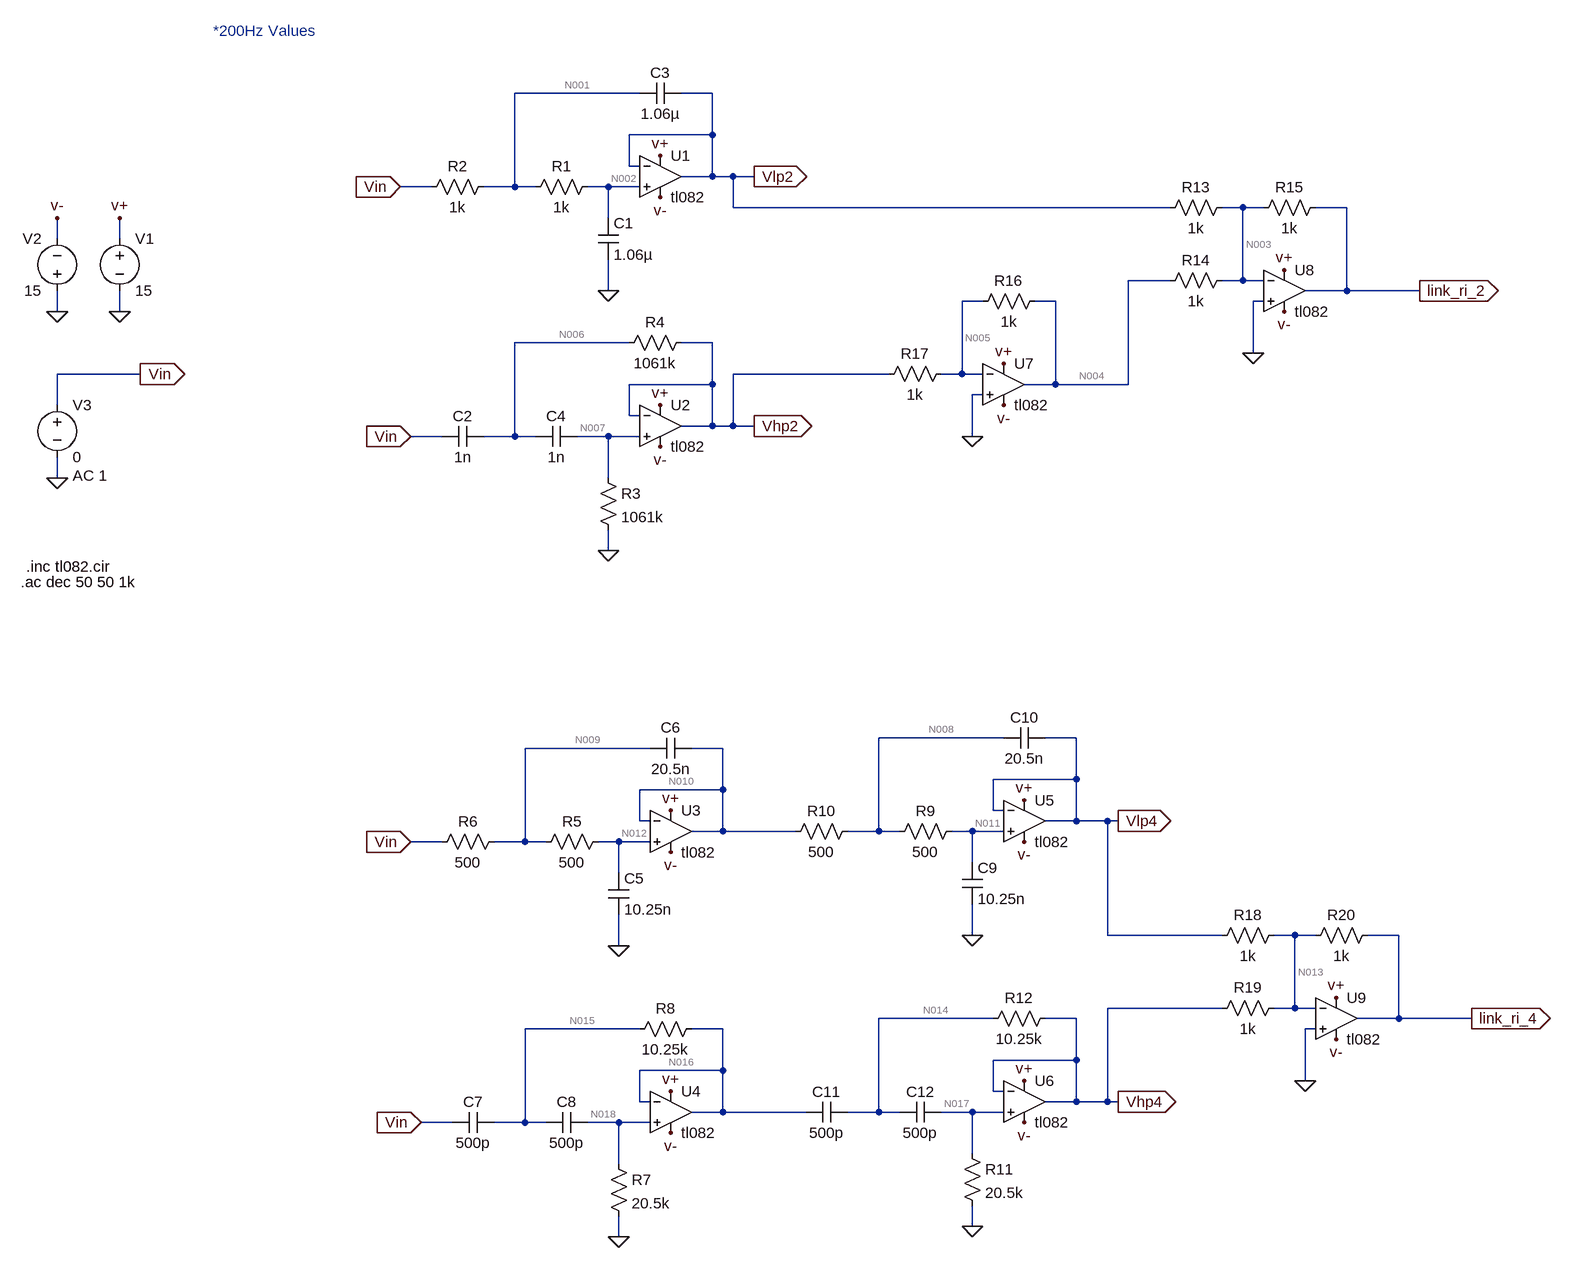
[diagram p0: schematic linkwitz_riley_2nd_order.asc]
linkwitz_riley_2nd_order.asc, the LTspice schematic file:
Version 4
SHEET 1 3200 1796
WIRE 512 16 320 16
WIRE 624 16 576 16
WIRE 624 80 624 16
WIRE 624 80 496 80
WIRE 496 128 496 80
WIRE 512 128 496 128
WIRE 624 144 624 80
WIRE 624 144 576 144
WIRE 656 144 624 144
WIRE 688 144 656 144
WIRE 192 160 144 160
WIRE 320 160 320 16
WIRE 320 160 272 160
WIRE 352 160 320 160
WIRE 464 160 432 160
WIRE 512 160 464 160
WIRE 656 192 656 144
WIRE 1328 192 656 192
WIRE 1440 192 1408 192
WIRE 1472 192 1440 192
WIRE 1600 192 1552 192
WIRE 464 208 464 160
WIRE -384 240 -384 208
WIRE -288 240 -288 208
WIRE 1328 304 1264 304
WIRE 1440 304 1440 192
WIRE 1440 304 1408 304
WIRE 1472 304 1440 304
WIRE 464 320 464 272
WIRE 1600 320 1600 192
WIRE 1600 320 1536 320
WIRE 1712 320 1600 320
WIRE 1040 336 1008 336
WIRE 1152 336 1120 336
WIRE 1472 336 1456 336
WIRE -384 352 -384 320
WIRE -288 352 -288 320
WIRE 496 400 320 400
WIRE 624 400 576 400
WIRE 1456 416 1456 336
WIRE -256 448 -384 448
WIRE 896 448 656 448
WIRE 1008 448 1008 336
WIRE 1008 448 976 448
WIRE 1040 448 1008 448
WIRE 624 464 624 400
WIRE 624 464 496 464
WIRE 1152 464 1152 336
WIRE 1152 464 1104 464
WIRE 1264 464 1264 304
WIRE 1264 464 1152 464
WIRE 1040 480 1024 480
WIRE -384 496 -384 448
WIRE 496 512 496 464
WIRE 512 512 496 512
WIRE 624 528 624 464
WIRE 624 528 576 528
WIRE 656 528 656 448
WIRE 656 528 624 528
WIRE 688 528 656 528
WIRE 208 544 160 544
WIRE 320 544 320 400
WIRE 320 544 272 544
WIRE 352 544 320 544
WIRE 464 544 416 544
WIRE 512 544 464 544
WIRE 1024 544 1024 480
WIRE -384 608 -384 576
WIRE 464 608 464 544
WIRE 464 720 464 688
WIRE 1072 1008 880 1008
WIRE 1184 1008 1136 1008
WIRE 528 1024 336 1024
WIRE 640 1024 592 1024
WIRE 1184 1072 1184 1008
WIRE 1184 1072 1056 1072
WIRE 640 1088 640 1024
WIRE 640 1088 512 1088
WIRE 1056 1120 1056 1072
WIRE 1072 1120 1056 1120
WIRE 512 1136 512 1088
WIRE 528 1136 512 1136
WIRE 1184 1136 1184 1072
WIRE 1184 1136 1136 1136
WIRE 1232 1136 1184 1136
WIRE 1248 1136 1232 1136
WIRE 640 1152 640 1088
WIRE 640 1152 592 1152
WIRE 752 1152 640 1152
WIRE 880 1152 880 1008
WIRE 880 1152 832 1152
WIRE 912 1152 880 1152
WIRE 1024 1152 992 1152
WIRE 1072 1152 1024 1152
WIRE 208 1168 160 1168
WIRE 336 1168 336 1024
WIRE 336 1168 288 1168
WIRE 368 1168 336 1168
WIRE 480 1168 448 1168
WIRE 528 1168 480 1168
WIRE 1024 1200 1024 1152
WIRE 480 1216 480 1168
WIRE 1024 1312 1024 1264
WIRE 1232 1312 1232 1136
WIRE 1408 1312 1232 1312
WIRE 1520 1312 1488 1312
WIRE 1552 1312 1520 1312
WIRE 1680 1312 1632 1312
WIRE 480 1328 480 1280
WIRE 1408 1424 1232 1424
WIRE 1520 1424 1520 1312
WIRE 1520 1424 1488 1424
WIRE 1552 1424 1520 1424
WIRE 1056 1440 880 1440
WIRE 1184 1440 1136 1440
WIRE 1680 1440 1680 1312
WIRE 1680 1440 1616 1440
WIRE 1792 1440 1680 1440
WIRE 512 1456 336 1456
WIRE 640 1456 592 1456
WIRE 1552 1456 1536 1456
WIRE 1184 1504 1184 1440
WIRE 1184 1504 1056 1504
WIRE 640 1520 640 1456
WIRE 640 1520 512 1520
WIRE 1536 1536 1536 1456
WIRE 1056 1552 1056 1504
WIRE 1072 1552 1056 1552
WIRE 512 1568 512 1520
WIRE 528 1568 512 1568
WIRE 1184 1568 1184 1504
WIRE 1184 1568 1136 1568
WIRE 1232 1568 1232 1424
WIRE 1232 1568 1184 1568
WIRE 1248 1568 1232 1568
WIRE 640 1584 640 1520
WIRE 640 1584 592 1584
WIRE 768 1584 640 1584
WIRE 880 1584 880 1440
WIRE 880 1584 832 1584
WIRE 912 1584 880 1584
WIRE 1024 1584 976 1584
WIRE 1072 1584 1024 1584
WIRE 224 1600 176 1600
WIRE 336 1600 336 1456
WIRE 336 1600 288 1600
WIRE 368 1600 336 1600
WIRE 480 1600 432 1600
WIRE 528 1600 480 1600
WIRE 1024 1648 1024 1584
WIRE 480 1664 480 1600
WIRE 1024 1760 1024 1728
WIRE 480 1776 480 1744
FLAG 544 112 v+
FLAG 544 496 v+
FLAG -288 208 v+
FLAG 544 176 v-
FLAG 544 560 v-
FLAG -384 208 v-
FLAG -384 352 0
FLAG -288 352 0
FLAG 688 144 Vlp2
IOPIN 688 144 Out
FLAG 688 528 Vhp2
IOPIN 688 528 Out
FLAG 464 320 0
FLAG 464 720 0
FLAG 144 160 Vin
IOPIN 144 160 In
FLAG 160 544 Vin
IOPIN 160 544 In
FLAG -256 448 Vin
IOPIN -256 448 Out
FLAG -384 608 0
FLAG 560 1120 v+
FLAG 560 1184 v-
FLAG 480 1328 0
FLAG 160 1168 Vin
IOPIN 160 1168 In
FLAG 560 1552 v+
FLAG 560 1616 v-
FLAG 480 1776 0
FLAG 176 1600 Vin
IOPIN 176 1600 In
FLAG 1104 1104 v+
FLAG 1104 1168 v-
FLAG 1248 1136 Vlp4
IOPIN 1248 1136 Out
FLAG 1024 1312 0
FLAG 1104 1536 v+
FLAG 1104 1600 v-
FLAG 1248 1568 Vhp4
IOPIN 1248 1568 Out
FLAG 1024 1760 0
FLAG 1072 432 v+
FLAG 1072 496 v-
FLAG 1504 288 v+
FLAG 1504 352 v-
FLAG 1456 416 0
FLAG 1712 320 link_ri_2
IOPIN 1712 320 Out
FLAG 1024 544 0
FLAG 1584 1408 v+
FLAG 1584 1472 v-
FLAG 1536 1536 0
FLAG 1792 1440 link_ri_4
IOPIN 1792 1440 Out
SYMBOL OpAmps\\opamp2 544 80 R0
SYMATTR InstName U1
SYMATTR Value tl082
SYMBOL OpAmps\\opamp2 544 464 R0
SYMATTR InstName U2
SYMATTR Value tl082
SYMBOL voltage -288 224 R0
SYMATTR InstName V1
SYMATTR Value 15
SYMBOL voltage -384 336 R180
WINDOW 0 24 96 Left 2
WINDOW 3 24 16 Left 2
SYMATTR InstName V2
SYMATTR Value 15
SYMBOL voltage -384 480 R0
WINDOW 123 24 124 Left 2
WINDOW 39 0 0 Left 0
SYMATTR Value2 AC 1
SYMATTR InstName V3
SYMATTR Value 0
SYMBOL res 448 144 R90
WINDOW 0 0 56 VBottom 2
WINDOW 3 32 56 VTop 2
SYMATTR InstName R1
SYMATTR Value 1k
SYMBOL res 288 144 R90
WINDOW 0 0 56 VBottom 2
WINDOW 3 32 56 VTop 2
SYMATTR InstName R2
SYMATTR Value 1k
SYMBOL cap 448 208 R0
SYMATTR InstName C1
SYMATTR Value 1.06µ
SYMBOL cap 576 0 R90
WINDOW 0 0 32 VBottom 2
WINDOW 3 32 32 VTop 2
SYMATTR InstName C3
SYMATTR Value 1.06µ
SYMBOL res 448 592 R0
SYMATTR InstName R3
SYMATTR Value 1061k
SYMBOL res 592 384 R90
WINDOW 0 0 56 VBottom 2
WINDOW 3 32 56 VTop 2
SYMATTR InstName R4
SYMATTR Value 1061k
SYMBOL cap 272 528 R90
WINDOW 0 0 32 VBottom 2
WINDOW 3 32 32 VTop 2
SYMATTR InstName C2
SYMATTR Value 1n
SYMBOL cap 416 528 R90
WINDOW 0 0 32 VBottom 2
WINDOW 3 32 32 VTop 2
SYMATTR InstName C4
SYMATTR Value 1n
SYMBOL OpAmps\\opamp2 560 1088 R0
SYMATTR InstName U3
SYMATTR Value tl082
SYMBOL res 464 1152 R90
WINDOW 0 0 56 VBottom 2
WINDOW 3 32 56 VTop 2
SYMATTR InstName R5
SYMATTR Value 500
SYMBOL res 304 1152 R90
WINDOW 0 0 56 VBottom 2
WINDOW 3 32 56 VTop 2
SYMATTR InstName R6
SYMATTR Value 500
SYMBOL cap 464 1216 R0
SYMATTR InstName C5
SYMATTR Value 10.25n
SYMBOL cap 592 1008 R90
WINDOW 0 0 32 VBottom 2
WINDOW 3 32 32 VTop 2
SYMATTR InstName C6
SYMATTR Value 20.5n
SYMBOL OpAmps\\opamp2 560 1520 R0
SYMATTR InstName U4
SYMATTR Value tl082
SYMBOL res 464 1648 R0
SYMATTR InstName R7
SYMATTR Value 20.5k
SYMBOL res 608 1440 R90
WINDOW 0 0 56 VBottom 2
WINDOW 3 32 56 VTop 2
SYMATTR InstName R8
SYMATTR Value 10.25k
SYMBOL cap 288 1584 R90
WINDOW 0 0 32 VBottom 2
WINDOW 3 32 32 VTop 2
SYMATTR InstName C7
SYMATTR Value 500p
SYMBOL cap 432 1584 R90
WINDOW 0 0 32 VBottom 2
WINDOW 3 32 32 VTop 2
SYMATTR InstName C8
SYMATTR Value 500p
SYMBOL OpAmps\\opamp2 1104 1072 R0
SYMATTR InstName U5
SYMATTR Value tl082
SYMBOL res 1008 1136 R90
WINDOW 0 0 56 VBottom 2
WINDOW 3 32 56 VTop 2
SYMATTR InstName R9
SYMATTR Value 500
SYMBOL res 848 1136 R90
WINDOW 0 0 56 VBottom 2
WINDOW 3 32 56 VTop 2
SYMATTR InstName R10
SYMATTR Value 500
SYMBOL cap 1008 1200 R0
SYMATTR InstName C9
SYMATTR Value 10.25n
SYMBOL cap 1136 992 R90
WINDOW 0 0 32 VBottom 2
WINDOW 3 32 32 VTop 2
SYMATTR InstName C10
SYMATTR Value 20.5n
SYMBOL OpAmps\\opamp2 1104 1504 R0
SYMATTR InstName U6
SYMATTR Value tl082
SYMBOL res 1008 1632 R0
SYMATTR InstName R11
SYMATTR Value 20.5k
SYMBOL res 1152 1424 R90
WINDOW 0 0 56 VBottom 2
WINDOW 3 32 56 VTop 2
SYMATTR InstName R12
SYMATTR Value 10.25k
SYMBOL cap 832 1568 R90
WINDOW 0 0 32 VBottom 2
WINDOW 3 32 32 VTop 2
SYMATTR InstName C11
SYMATTR Value 500p
SYMBOL cap 976 1568 R90
WINDOW 0 0 32 VBottom 2
WINDOW 3 32 32 VTop 2
SYMATTR InstName C12
SYMATTR Value 500p
SYMBOL OpAmps\\opamp2 1072 400 R0
SYMATTR InstName U7
SYMATTR Value tl082
SYMBOL OpAmps\\opamp2 1504 256 R0
SYMATTR InstName U8
SYMATTR Value tl082
SYMBOL res 1424 176 R90
WINDOW 0 0 56 VBottom 2
WINDOW 3 32 56 VTop 2
SYMATTR InstName R13
SYMATTR Value 1k
SYMBOL res 1424 288 R90
WINDOW 0 0 56 VBottom 2
WINDOW 3 32 56 VTop 2
SYMATTR InstName R14
SYMATTR Value 1k
SYMBOL res 1568 176 R90
WINDOW 0 0 56 VBottom 2
WINDOW 3 32 56 VTop 2
SYMATTR InstName R15
SYMATTR Value 1k
SYMBOL res 1136 320 R90
WINDOW 0 0 56 VBottom 2
WINDOW 3 32 56 VTop 2
SYMATTR InstName R16
SYMATTR Value 1k
SYMBOL res 992 432 R90
WINDOW 0 0 56 VBottom 2
WINDOW 3 32 56 VTop 2
SYMATTR InstName R17
SYMATTR Value 1k
SYMBOL OpAmps\\opamp2 1584 1376 R0
SYMATTR InstName U9
SYMATTR Value tl082
SYMBOL res 1504 1296 R90
WINDOW 0 0 56 VBottom 2
WINDOW 3 32 56 VTop 2
SYMATTR InstName R18
SYMATTR Value 1k
SYMBOL res 1504 1408 R90
WINDOW 0 0 56 VBottom 2
WINDOW 3 32 56 VTop 2
SYMATTR InstName R19
SYMATTR Value 1k
SYMBOL res 1648 1296 R90
WINDOW 0 0 56 VBottom 2
WINDOW 3 32 56 VTop 2
SYMATTR InstName R20
SYMATTR Value 1k
TEXT -432 744 Left 2 !.inc tl082.cir
TEXT -440 768 Left 2 !.ac dec 50 50 1k
TEXT -144 -80 Left 2 ;*200Hz Values

The netlist it stands for:
* linkwitz_riley_2nd_order.asc
XU1 N002 Vlp2 v+ v- Vlp2 tl082  ; pins In+ In- V+ V- OUT
XU2 N007 Vhp2 v+ v- Vhp2 tl082  ; pins In+ In- V+ V- OUT
V1 v+ 0 15
V2 0 v- 15
V3 Vin 0 0 AC 1
R1 N002 N001 1k
R2 N001 Vin 1k
C1 N002 0 1.06µ
C3 Vlp2 N001 1.06µ
R3 N007 0 1061k
R4 Vhp2 N006 1061k
C2 N006 Vin 1n
C4 N007 N006 1n
XU3 N012 N010 v+ v- N010 tl082  ; pins In+ In- V+ V- OUT
R5 N012 N009 500
R6 N009 Vin 500
C5 N012 0 10.25n
C6 N010 N009 20.5n
XU4 N018 N016 v+ v- N016 tl082  ; pins In+ In- V+ V- OUT
R7 N018 0 20.5k
R8 N016 N015 10.25k
C7 N015 Vin 500p
C8 N018 N015 500p
XU5 N011 Vlp4 v+ v- Vlp4 tl082  ; pins In+ In- V+ V- OUT
R9 N011 N008 500
R10 N008 N010 500
C9 N011 0 10.25n
C10 Vlp4 N008 20.5n
XU6 N017 Vhp4 v+ v- Vhp4 tl082  ; pins In+ In- V+ V- OUT
R11 N017 0 20.5k
R12 Vhp4 N014 10.25k
C11 N014 N016 500p
C12 N017 N014 500p
XU7 0 N005 v+ v- N004 tl082  ; pins In+ In- V+ V- OUT
XU8 0 N003 v+ v- link_ri_2 tl082  ; pins In+ In- V+ V- OUT
R13 N003 Vlp2 1k
R14 N003 N004 1k
R15 link_ri_2 N003 1k
R16 N004 N005 1k
R17 N005 Vhp2 1k
XU9 0 N013 v+ v- link_ri_4 tl082  ; pins In+ In- V+ V- OUT
R18 N013 Vlp4 1k
R19 N013 Vhp4 1k
R20 link_ri_4 N013 1k
.inc tl082.cir
.ac dec 50 50 1k
* *200Hz Values
.backanno
.end

* Results of the author's LTspice run, read from the files saved beside the schematic
* Operating Point, zero values left out:
*   V(vlp2) = 10.88 µV
*   V(v-) = -15 V
*   V(v+) = 15 V
*   V(n002) = -90.11 nV
*   V(vhp2) = -36.83 µV
*   V(n007) = -47.8 µV
*   V(n001) = -45.05 nV
*   V(n006) = -36.83 µV
*   V(n010) = 10.93 µV
*   V(n012) = -45.05 nV
*   V(n009) = -22.53 nV
*   V(n016) = 10.05 µV
*   V(n018) = -923.6 nV
*   V(n015) = 10.05 µV
*   V(vlp4) = 21.85 µV
*   V(n011) = 10.88 µV
*   V(n008) = 10.9 µV
*   V(vhp4) = 10.05 µV
*   V(n017) = -923.6 nV
*   V(n014) = 10.05 µV
*   V(n004) = 58.81 µV
*   V(n005) = 10.97 µV
*   V(link_ri_2) = -36.74 µV
*   V(n003) = 10.97 µV
*   V(link_ri_4) = 1.059 µV
*   V(n013) = 10.97 µV
*   I(R20) = -9.911 nA
*   I(R19) = 923.6 pA
*   I(R18) = -10.88 nA
*   I(R17) = 47.8 nA
*   I(R16) = 47.84 nA
*   I(R15) = -47.71 nA
*   I(R14) = -47.84 nA
*   I(R13) = 90.37 pA
*   I(R11) = -45.05 pA
*   I(R10) = -45.05 pA
*   I(R9) = -45.05 pA
*   I(R7) = -45.05 pA
*   I(R6) = -45.05 pA
*   I(R5) = -45.05 pA
*   I(R3) = -45.05 pA
*   I(R2) = -45.05 pA
*   I(R1) = -45.05 pA
*   I(V3) = -90.11 pA
*   I(V2) = -127.8 mA
*   I(V1) = -127.7 mA
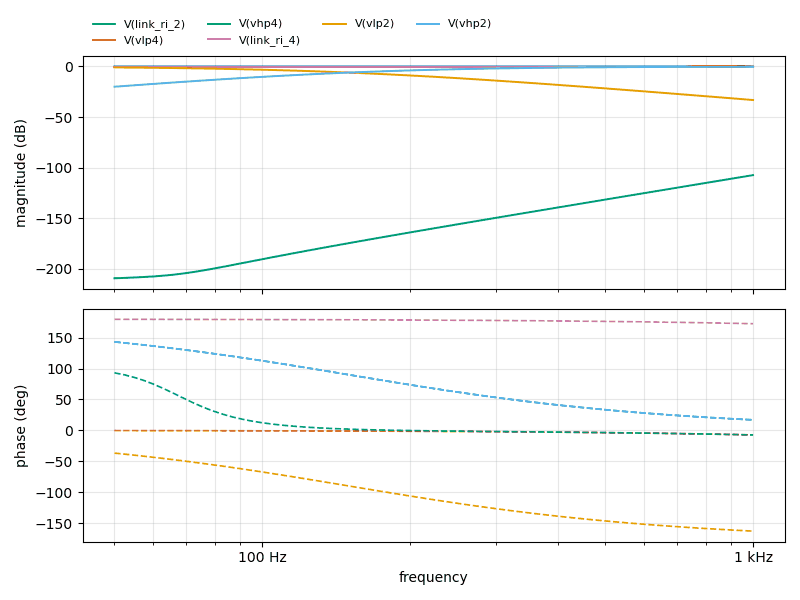
[diagram p1: AC Analysis of linkwitz_riley_2nd_order.asc, plotted from the saved traces]
* AC Analysis, 1 run:
*   V(link_ri_2): 0.00 dB at 50 Hz, -0.00 dB at 1 kHz, peak 0.00 dB at 144.2 Hz
*   V(vlp4): -0.00 dB at 50 Hz, -0.00 dB at 1 kHz, peak -0.00 dB at 1 kHz
*   V(vhp4): -209.32 dB at 50 Hz, -107.36 dB at 1 kHz, peak -107.36 dB at 1 kHz, 3 dB below the peak at 917.2 Hz
*   V(link_ri_4): -0.00 dB at 50 Hz, -0.00 dB at 1 kHz, peak -0.00 dB at 1 kHz
*   V(vlp2): -0.91 dB at 50 Hz, -33.14 dB at 1 kHz, peak -0.91 dB at 50 Hz, 3 dB below the peak at 113.4 Hz
*   V(vhp2): -20.00 dB at 50 Hz, -0.19 dB at 1 kHz, peak -0.19 dB at 1 kHz, 3 dB below the peak at 224.7 Hz